# Altium schematic sheet 1_ESP8266_Hot_Plate.SchDoc
size A4; SheetNumber: 2; SheetTotal: 2
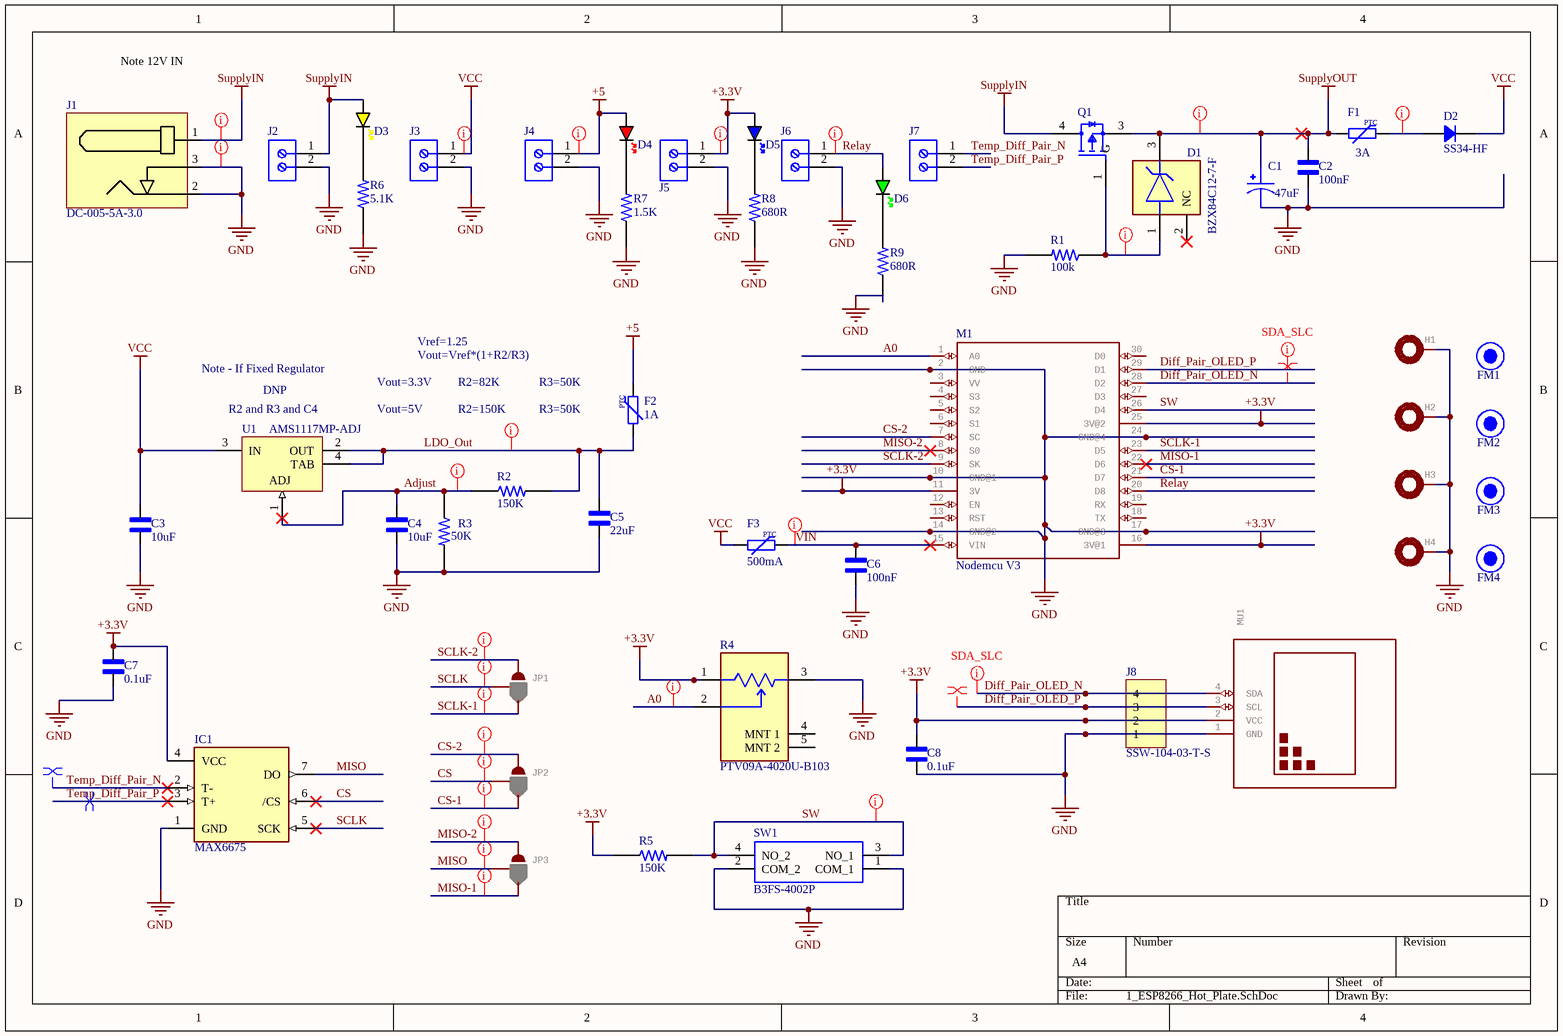
[diagram p0: 1_ESP8266_Hot_Plate.SchDoc]

## Parts
C1  47uF  [1411-3528]
C2  100nF  [C-0603]
C3  10uF  [C-0603]
C4  10uF  [C-0603]
C5  22uF  [C-0603]
C6  100nF  [C-0603]
C7  0.1uF  [C-0603]
C8  0.1uF  [C-0603]
D1  BZX84C12-7-F  [FP-SOT23-MFG]
D2  SS34-HF  [DO214AC SMA]
D3  YELLOW  [LED_0603_YELLOW]  (value not drawn)
D4  RED  [LED_0603_RED]  (value not drawn)
D5  BLUE  [LED_0603_BLUE]  (value not drawn)
D6  GREEN  [LED_0603_GREEN]  (value not drawn)
F1  3A  [FUSE_1206]
F2  1A  [FUSE_1206]
F3  500mA  [FUSE_1206]
FM1  FIDUCIAL  [FIDUCIAL-1MM]  (value not drawn)
FM2  FIDUCIAL  [FIDUCIAL-1MM]  (value not drawn)
FM3  FIDUCIAL  [FIDUCIAL-1MM]  (value not drawn)
FM4  FIDUCIAL  [FIDUCIAL-1MM]  (value not drawn)
H1  MOUNTING PAD, round  [2,4-PAD]  (value not drawn)
H2  MOUNTING PAD, round  [2,4-PAD]  (value not drawn)
H3  MOUNTING PAD, round  [2,4-PAD]  (value not drawn)
H4  MOUNTING PAD, round  [2,4-PAD]  (value not drawn)
IC1  MAX6675  [SO08]
J1  DC-005-5A-3.0  [DC-005-5A-3.0]
J2  691214110002  [691214110002]  (value not drawn)
J3  691214110002  [691214110002]  (value not drawn)
J4  691214110002  [691214110002]  (value not drawn)
J5  691214110002  [691214110002]  (value not drawn)
J6  691214110002  [691214110002]  (value not drawn)
J7  691214110002  [691214110002]  (value not drawn)
J8  SSW-104-03-T-S  [SAMTEC SSW-104-03-T-S]
JP1  JUMPER-SMT_3_1-NC_PASTE_SILK  [SMT-JUMPER_3_1-NC_PASTE_SILK]  (value not drawn)
JP2  JUMPER-SMT_3_1-NC_PASTE_SILK  [SMT-JUMPER_3_1-NC_PASTE_SILK]  (value not drawn)
JP3  JUMPER-SMT_3_1-NC_PASTE_SILK  [SMT-JUMPER_3_1-NC_PASTE_SILK]  (value not drawn)
M1  Nodemcu V3  [NODEMCU]
MU1  128x64 Dot Matrix OLED Module based on SSD1306  [DISPLAY-OLED-128X64-I2C]  (value not drawn)
Q1  FDD6637  [FP-369AS-MFG]  (value not drawn)
R1  100k  [R-0603]
R2  150K  [R-0603]
R3  50K  [R-0603]
R4  PTV09A-4020U-B103  [FP-PTV09A-4-MFG]
R5  150K  [R-0603]
R6  5.1K  [R-0603]
R7  1.5K  [R-0603]
R8  680R  [R-0603]
R9  680R  [R-0603]
SW1  B3FS-4002P  [B3FS4002P]
U1  AMS1117MP-ADJ  [MP04A_N]

## Nets
+3.3V: C7.2 C8.2 D5.A IC1.4(VCC) J5.1 J8.2 M1.11(3V) M1.16(3V@1) M1.25(3V@2) MU1.2(VCC) R4.1 R5.1
+5: D4.A F2.2 J4.1
GND: C1.2 C2.1 C3.1 C4.1 C5.1 C6.1 C7.1 C8.1 H1.1(MOUNT) H2.1(MOUNT) H3.1(MOUNT) H4.1(MOUNT) IC1.1(GND) J1.2 J1.3 J2.2 J3.2 J4.2 J5.2 J6.2 J8.1 M1.2(GND) M1.10(GND@1) M1.14(GND@2) M1.17(GND@3) M1.24(GND@4) MU1.1(GND) R1.2 R3.2 R4.3 R6.1 R7.1 R8.1 R9.1 SW1.1(COM_1) SW1.2(COM_2)
SupplyIN: D3.A J1.1 J2.1 Q1.4(D)
SupplyOUT: C1.1 C2.2 D1.3(C) F1.1 Q1.3(S)
VCC: C3.2 D2.2 F3.1 J3.1 U1.3(IN)
A0: M1.1(A0) R4.2
Adjust: C4.2 R2.1 R3.1 U1.1(ADJ)
CS: IC1.6(/CS) JP2.2
CS-1: JP2.3 M1.21(D7)
CS-2: JP2.1 M1.7(SC)
Diff_Pair_OLED_N: J8.4 M1.28(D2) MU1.4(SDA)
Diff_Pair_OLED_P: J8.3 M1.29(D1) MU1.3(SCL)
LDO_Out: C5.2 F2.1 R2.2 U1.2(OUT) U1.4(TAB)
MISO: IC1.7(DO) JP3.2
MISO-1: JP3.3 M1.22(D6)
MISO-2: JP3.1 M1.8(S0)
Relay: D6.A J6.1 M1.20(D8)
SCLK: IC1.5(SCK) JP1.2
SCLK-1: JP1.3 M1.23(D5)
SCLK-2: JP1.1 M1.9(SK)
SW: M1.26(D4) R5.2 SW1.3(NO_1) SW1.4(NO_2)
Temp_Diff_Pair_N: IC1.2(T-) J7.1
Temp_Diff_Pair_P: IC1.3(T+) J7.2
VIN: C6.2 F3.2 M1.15(VIN)
NetD1_1: D1.1(A) Q1.1(G) R1.1
NetD2_1: D2.1 F1.2
NetD3_K: D3.K R6.2
NetD4_K: D4.K R7.2
NetD5_K: D5.K R8.2
NetD6_K: D6.K R9.2

Not connected (* = marked no-connect by the designer): D1 2(NC)*; M1 3(VV) 4(S3) 5(S2) 6(S1) 12(EN) 13(RST) 18(TX) 19(RX) 27(D3) 30(D0); R4 4(MNT_1) 5(MNT_2)

## Layout directives
net class Power; rule Supply Nets [Voltage = 0.000]: +3.3V, +5, LDO_Out, NetD1_1, NetD2_1, Relay, SupplyIN, SupplyOUT, VCC
net class GND; rule Supply Nets [Voltage = 0.000]: GND
net class Signal; rule Supply Nets [Voltage = 0.000]: Adjust
net class Signal: A0, CS, CS-1, CS-2, MISO, MISO-1, MISO-2, SCLK, SCLK-1, SCLK-2, SW
net class Power: VIN
differential pair; differential pair class Temp_Diff_Pair: Temp_Diff_Pair_N, Temp_Diff_Pair_P
differential pair; differential pair class SDA_SLC: Diff_Pair_OLED_N, Diff_Pair_OLED_P

## Notes on the sheet
- Note 12V IN
- Note - If Fixed Regulator
- DNP
- Vout=3.3V
- Vout=Vref*(1+R2/R3)
- Vref=1.25
- R2=82K
- R3=50K
- (near U1) R2 and R3 and C4
- Vout=5V
- R2=150K
- (in symbol FUSE_PPTC_1206) PTC

## Library data of the parts
C1 = C-1411 (3528 Metric): Molded Tantalum Capacitors 16V 1411 (3528 Metric); MF: KEMET; MP: T495B106K025ATE750; Package: 1411 KEMET; Value: *; Availability: Unavailable; SnapEDA_Link: https://www.snapeda.com/parts/T495B106K025ATE750/KEMET/view-part/1680496/?ref=snap; Price: None
C2-C8 = C-0603: Ceramic Capacitor 16V 0603 (1608 Metric); MP: C0603C104J4RAC; MF: KEMET; SnapEDA_Link: https://www.snapeda.com/parts/C0603C104J4RAC/KEMET/view-part/1763758/?ref=snap; Availability: Warning; Package: 0603 KEMET; Check_prices: https://www.snapeda.com/parts/C0603C104J4RAC/KEMET/view-part/1763758/?ref=eda; Value: *; Price: None
D1 = CMP-12792-000017-1: DIODE ZENER 12V 300MW SOT23-3; Manufacturer: Diodes Inc.; Max Reverse Leakage Current: 0.1uA; Max Zener Voltage: 12.7V; Reverse Voltage: 8V; Zener Impedance: 25Ω; Max Junction Temp: +150°C; Standoff Height: 0.013mm; Height: 1.1mm; RoHS: TRUE; Manufacturer Part Number: BZX84C12-7-F; Digikey Description: DIODE ZENER 12V 300MW SOT23-3; Device Class L2: Diodes; Power Dissipation: 300mW; Category: Diode; Device Class L3: Zener Diodes; Footprint Url: https://www.diodes.com/assets/Package-Files/SOT23.pdf; Nom Zener Voltage: 12V; Temperature: -65°C to +150°C; ComponentLink2Description: Datasheet; Lead Free: Yes; ComponentLink2URL: https://www.diodes.com/assets/Datasheets/ds18001.pdf; Mouser Description: Zener Diodes 12V 350mW; Temperature Range Low: -65°C; Automotive: No; Package: SOT23; Ipc Land Pattern Name: SOT92P240X102-3; Temperature Range High: +150°C; Octopart: https://octopart.com/bzx84c12-7-f-diodes+inc.-327696; Device Class L1: Discrete Semiconductors
D2 = SS34-HF: DIODE SCHOTTKY 40V 3A DO214AC; Manufacturer: Comchip Technology; Capacitance @ Vr, F: 450pF @ 4V, 1MHz; Current - Reverse Leakage @ Vr: 500 µA @ 40 V; Speed: Fast Recovery =< 500ns, > 200mA (Io); Voltage - Forward (Vf) (Max) @ If: 550 mV @ 3 A; Part Number: SS34-HF; ComponentLink2Description: DigiKey Link; ComponentLink2URL: https://www.digikey.com/en/products/detail/comchip-technology/SS34-HF/10279693; Current - Average Rectified (Io): 3A; Diode Type: Schottky; LastUpdated: 02-01-2023 08:53:33 PM; Lifecycle Status: Active; Minimum Order: 1; Mounting Type: Surface Mount; Package / Case: DO-214AC, SMA; Packaging: TapeAndReel; PartId: 2138; Price: 0.07; Supplier 1: DigiKey; Supplier Part Number 1: 641-2115-1-ND; Supplier Device Package: DO-214AC (SMA); Voltage - DC Reverse (Vr) (Max): 40 V; ComponentLink1Description: Datasheet; ComponentLink1URL: http://www.comchiptech.com/admin/files/product/20190514101641.pdf; Operating Temperature - Junction: -55°C ~ 125°C; Part Status: Active; Series: -
D3 = LED_0603_YELLOW: LED 0603 YELLOW SMD
D4 = LED_0603_RED: LED 0603 RED SMD
D5 = LED_0603_BLUE: LED 0603 BLUE SMD
D6 = LED_0603_GREEN: LED 0603 GREEN SMD
F1-F3 = FUSE_PPTC_1206: Fuse PPTC SMD 1206; Manufacturer: *; Manufacturer Part Number: *
H1-H4 = MOUNT-PAD-ROUND2.4: GateName_1: G$1; DeviceName: 2.8; POPULARITY: 6; SymbolName_1: MOUNT-PAD; LibraryName: Holes-Custom; DeviceSetName: MOUNT-PAD-ROUND; Package: 2,8-PAD
IC1 = MAX6675: IC THERMOCOUP TO DGTL 8-SOIC; MF: Maxim Integrated; Package: SOIC-8 Maxim Integrated; Availability: Unavailable; MP: MAX6675; Value: *; SnapEDA_Link: https://www.snapeda.com/parts/MAX6675/Maxim%20Integrated/view-part/558569/?ref=snap; Price: None
J1 = DC-005-5A-3.0: DC Barrell Jack 6.2mm 5 A3.0mm Through Hole; Parameter 1: XKB; Parameter 2: DC-005-5A-3.0
J2-J7 = CMP-1502-02464-1: Serie 2141 - 3.50 mm Horizontal Entry Modular with Rising Cage Clamp WR-TBL, 2 pin; Manufacturer: Wurth Elektronik; Pin Number: 2; Pitch: 3.50mm; Datasheet URL: http://katalog.we-online.de/em/datasheet/6912141100xx.pdf; Packaging: Box; Mounting Technology: THT; Package Reference: 691214110002; Manufacturer URL: http://www.we-online.de; Part Number: 691214110002; Publisher: WurthElektronik; Operating Temperature: -40to105degC
J8 = SSW-104-03-T-S: CONN RCPT 4POS 0.1 TIN PCB; Manufacturer: Samtec Inc.; Connector Type: Receptacle; Current Rating (Amps): 5.7A per Contact; Material Flammability Rating: UL94 V-0; Number of Positions: 4; Number of Positions Loaded: All; Style: Board to Board or Cable; Part Number: SSW-104-03-T-S; ComponentLink2Description: DigiKey Link; ComponentLink2URL: http://digikey.com/product-detail/en/samtec-inc/SSW-104-03-T-S/SSW-104-03-T-S-ND/7874034; Contact Finish - Mating: Tin; Contact Finish - Post: Tin; Contact Type: Forked; Fastening Type: Push-Pull; Insulation Color: Black; LastUpdated: 21-06-2022 03:08:52 PM; Lifecycle Status: Active; Minimum Order: 1; Mounting Type: Through Hole; Number of Rows: 1; Operating Temperature: -55°C ~ 105°C; Packaging: Bulk; Part Status: Active; Price: 0.83; Series: SSW; Supplier 1: DigiKey; Supplier Part Number 1: SSW-104-03-T-S-ND; Termination: Solder
JP1-JP3 = JUMPER-SMT_3_1-NC_PASTE_SILK: Normally closed solder jumper (1 of 2 connections)    This jumper has an aperture in the stencil to allow solder paste to bridge one of the two connections. One connection is normally closed (NC), while the other is normally open (NO). Wick off the solder to open the connection. Reapply solder to reclose the connection. Apply solder to the other side instead to change the current path.; GateName_1: G$1; SymbolName_1: SMT-JUMPER_3_1-NC_PASTE; DeviceName: _SILK; LibraryName: SparkFun-Jumpers; DeviceSetName: JUMPER-SMT_3_1-NC_PASTE; Package: SMT-JUMPER_3_1-NC_PASTE_SILK
M1 = NODEMCU: Node MCU V3 Module; GateName_1: G$1; SymbolName_1: NODEMCU; LibraryName: nodemcu; DeviceSetName: NODEMCU; Package: NODEMCU
MU1 = DISPLAY-OLED-128X64-I2C: 128x64 Dot Matrix OLED Module based on SSD1306 chip Variant with I2C interface   More details available here: http://www.instructables.com/id/Monochrome-096-i2c-OLED-display-with-arduino-SSD13/   SSD1306 datasheet: https://cdn-shop.adafruit.com/datasheets/SSD1306.pdf   Click here to find device on ebay.com Note: There are two variants: I2C and SPI. Search for the proper version.; GateName_1: G$1; SymbolName_1: DISPLAY-OLED-128X64-I2C; LibraryName: diy-modules; DeviceSetName: DISPLAY-OLED-128X64-I2C; Package: DISPLAY-OLED-128X64-I2C
Q1 = CMP-07173-000090-1: MOSFET P-CH 35V 13A DPAK; Manufacturer: ON Semiconductor; Threshold Vgs Max: -3V; Transconductance: 35S; Rthja Max: 96°C/W; Pulse Drain Current: -100A; Reverse Recovery Time: 28ns; Number Of P Channels: 1; Drain To Source Voltage: -35V; Turn On Delay Time: 18ns; Depletion Mode: False; Turn Off Delay Time: 62ns; Max Junction Temp: +150°C; Gate To Source Voltage: 25V; Gate Charge At Vgs: 45nC @ -10V; Threshold Vgs Min: -1V; Drain To Source Resistance: 9.7mΩ; Power Dissipation: 1.3W; Typ Forward Diode Voltage: -0.8V; Input Capacitace At Vds: 2370pF @ -20V; Max Forward Diode Voltage: -1.2V; Continuous Drain Current: -13A; Reverse Recovery Charge: 15nC; Temperature: -55°C to +150°C; Package: 369AS; Device Class L2: Transistors; Automotive: No; ComponentLink2URL: https://www.onsemi.com/pub/Collateral/FDD6637-D.pdf; Temperature Range Low: -55°C; Manufacturer Part Number: FDD6637; Number Of Channels: 1; Lead Free: Yes; Temperature Range High: +150°C; ComponentLink2Description: Datasheet; RoHS: TRUE; Octopart: https://octopart.com/fdd6637-on+semiconductor-84325825; Drain To Source Breakdown Voltage: -35V; Footprint Url: https://www.onsemi.com/pub/Collateral/369AS.PDF; Category: Trans; Device Class L1: Discrete Semiconductors; Digikey Description: MOSFET P-CH 35V 13A DPAK; Device Class L3: MOSFETs; Mouser Description: MOSFET 35V PCH PowerTrench MOSFET; Height: 2.517mm
R1-R3 R5-R9 = R-0603: 0603; MP: 2-1623703-0; Power_Rating: .1 W; Value: 10K; Tolerance: 1%; MF: TE Connectivity; Package: 0603; Price: None; Resistance: 10K; Check_prices: https://www.snapeda.com/parts/2-1623703-0/TE%20Connectivity/view-part/2213192/?ref=eda; SnapEDA_Link: https://www.snapeda.com/parts/2-1623703-0/TE%20Connectivity/view-part/2213192/?ref=snap; Availability: Warning
R4 = CMP-07234-000013-1: POT 10K OHM 1/20W CARBON LINEAR; Manufacturer: Bourns Inc.; Voltage Rating: 50V; Resistance: 10kΩ; Tolerance: 20%; Value: 10kΩ; Power Rating: 0.05W; Composition: Carbon; Lead Free: Yes; Device Class L1: Passive Components; Device Class L3: Variable Resistors and Potentiometers; Temperature: -10°C to +50°C; Series: PTV09; Manufacturer Part Number: PTV09A-4020U-B103; Device Class L2: Resistors; Temperature Range Low: -10°C; Height: 20.5mm; Temperature Range High: +50°C; Octopart: https://octopart.com/ptv09a-4020u-b103-bourns-1878033; Digikey Description: POT 10K OHM 1/20W CARBON LINEAR; RoHS: TRUE; ComponentLink2URL: https://www.bourns.com/docs/product-datasheets/ptv09.pdf?sfvrsn=5e1089f1_12; Package: PTV09A-4; Mouser Description: Potentiometers 10K LINEAR 20%; Category: Res; ComponentLink2Description: Datasheet; Automotive: No
SW1 = Tactile Switch 12x12mm: Black Cap Tactile Switch, SPST-NO 50 mA @ 24 V dc 0.4mm; Manufacturer_Name: Omron Electronics; Geometry.Height: 4mm; Mouser Part Number: 653-B3FS-4002P; Mouser Price/Stock: https://www.mouser.co.uk/ProductDetail/Omron-Electronics/B3FS-4002P?qs=%2Fv%252BM2iqGzeVovpzrTEhCpQ%3D%3D; Manufacturer_Part_Number: B3FS-4002P; Datasheet Link: http://omronfs.omron.com/en_US/ecb/products/pdf/en-b3fs_4.pdf
U1 = CMP-0062-01645-3: 800mA Low-Dropout Linear Regulator, 4-pin SOT-223; PartNumber: LM1117MP-ADJ; Manufacturer: National Semiconductor; High-Reliability: Y; PackageTopMarking: XYTT*N03A; CompType: LDO IC; PowerWise: N; ComponentLink2URL: http://www.national.com/ds/LM/LM1117.pdf; ComponentLink1Description: Manufacturer URL; DatasheetVersion: Apr-2006; PackageReference: MP04A; RoHS: N; ComponentLink3Description: LM1117 Web Page; RevisionNote: SCH symbol layout adjusted; PackageDescription: Molded SOT-223, 6.50 x 3.56 x 1.6mm Body, 4 Lead, 2.3mm Pitch; Code_IPC: SOT223-4; ComponentLink1URL: http://www.national.com/; ComponentLink4Description: MP04A Package Page; ComponentLink3URL: http://www.national.com/pf/LM/LM1117.html; PackageVersion: revB, Apr-2003; ComponentLink2Description: LM1117 Datasheet; PinCount: 4; ComponentLink4URL: http://www.national.com/packaging/folders/mp04a.html; Code_JEDEC: TO-261-AA